# Altium schematic sheet 03 - AEM10941.SchDoc: Boost Converter
size A4; DrawnBy: LS, OB, AB, AG, IM; Organization: Miromico, ETHZ; Revision: 3; SheetNumber: 4; SheetTotal: 5; SchemaTitle: Harvester
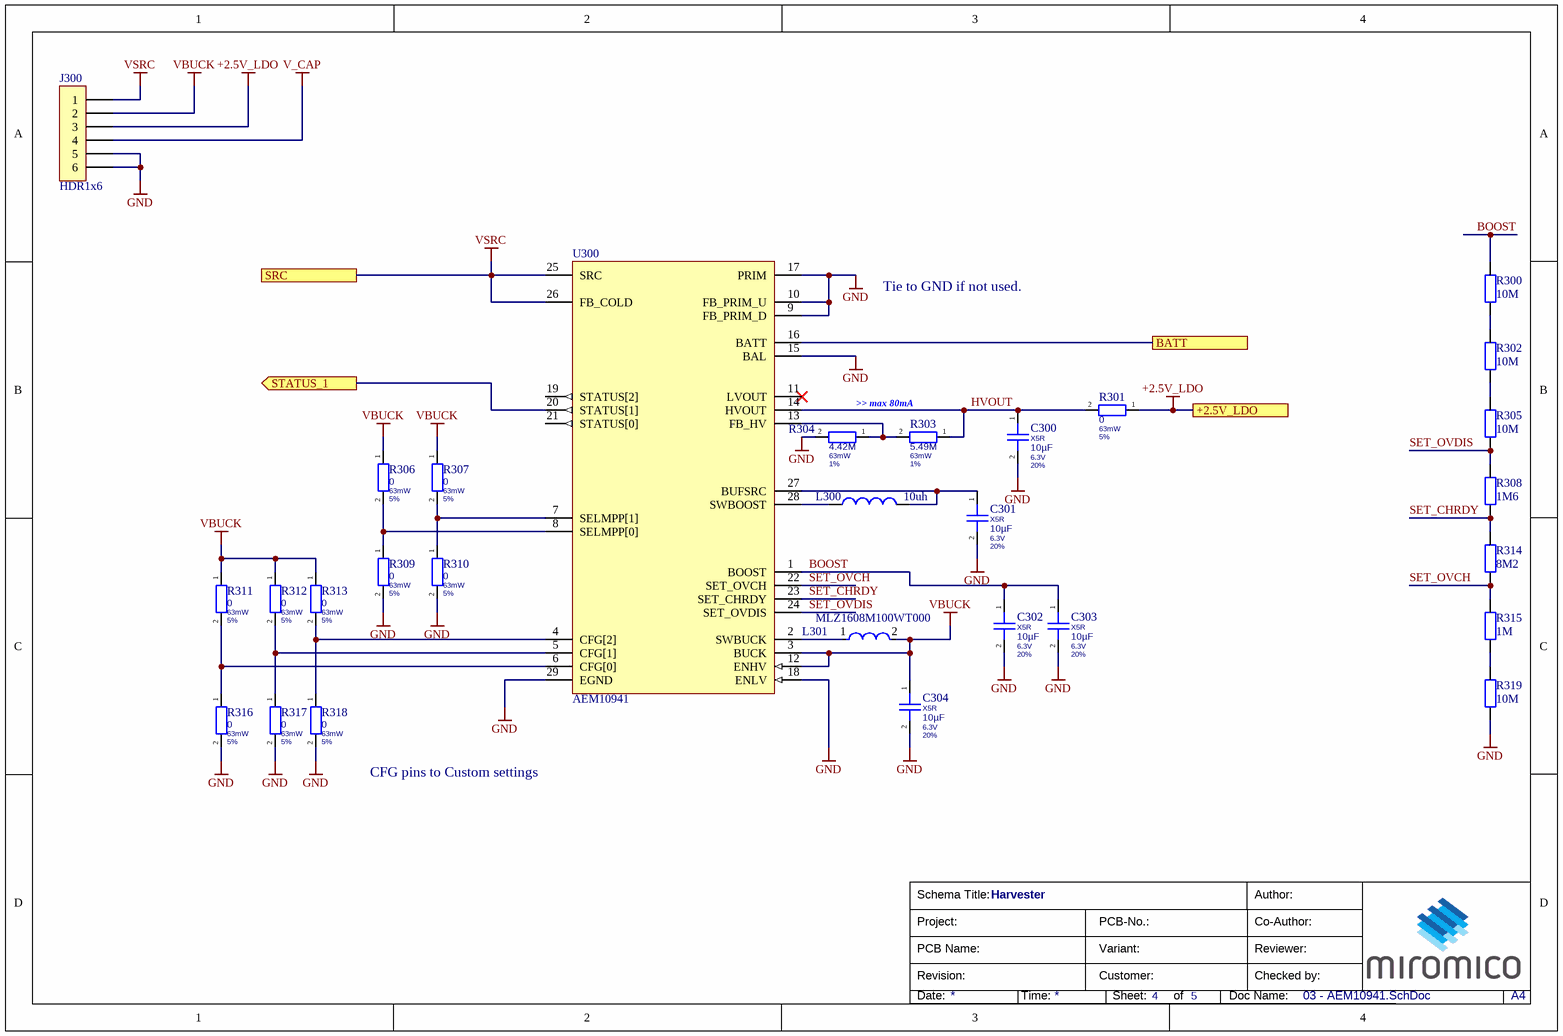
[diagram p0: 03 - AEM10941.SchDoc]

## Parts
C300  Dielectric: X5R  Capacitance: 10µF  Voltage Rating: 6.3V  Tolerance: 20%  [CAPC0402(1005)60_L]  (hidden comment: GRJ155R60J106ME11D)
C301  Dielectric: X5R  Capacitance: 10µF  Voltage Rating: 6.3V  Tolerance: 20%  [CAPC0402(1005)60_L]  (hidden comment: GRJ155R60J106ME11D)
C302  Dielectric: X5R  Capacitance: 10µF  Voltage Rating: 6.3V  Tolerance: 20%  [CAPC0402(1005)60_L]  (hidden comment: GRJ155R60J106ME11D)
C303  Dielectric: X5R  Capacitance: 10µF  Voltage Rating: 6.3V  Tolerance: 20%  [CAPC0402(1005)60_L]  (hidden comment: GRJ155R60J106ME11D)
C304  Dielectric: X5R  Capacitance: 10µF  Voltage Rating: 6.3V  Tolerance: 20%  [CAPC0402(1005)60_L]  (hidden comment: GRJ155R60J106ME11D)
J300  HDR1x6  [HDR1x6]
L300  Inductance: 10uh  [INDC0805(2012)X11_L]  (hidden comment: CKS2125100M-T)
L301  MLZ1608M100WT000  [FP-MLZ1608-MFG]
R300  10M  [RESC0402(1005)_L]
R301  Resistance: 0  Power Rating: 63mW  Tolerance: 5%  [RESC0402(1005)_L]  (hidden comment: RMCF0402ZT0R00)
R302  10M  [RESC0402(1005)_L]
R303  Resistance: 5.49M  Power Rating: 63mW  Tolerance: 1%  [RESC0402(1005)_L]  (hidden comment: CRCW04025M49FKED)
R304  Resistance: 4.42M  Power Rating: 63mW  Tolerance: 1%  [RESC0402(1005)_L]  (hidden comment: CRCW04024M42FKED)
R305  10M  [RESC0402(1005)_L]
R306  Resistance: 0  Power Rating: 63mW  Tolerance: 5%  [RESC0402(1005)_L]  (hidden comment: RMCF0402ZT0R00)
R307  Resistance: 0  Power Rating: 63mW  Tolerance: 5%  [RESC0402(1005)_L]  (hidden comment: RMCF0402ZT0R00)
R308  1M6  [RESC0402(1005)_L]
R309  Resistance: 0  Power Rating: 63mW  Tolerance: 5%  [RESC0402(1005)_L]  (hidden comment: RMCF0402ZT0R00)
R310  Resistance: 0  Power Rating: 63mW  Tolerance: 5%  [RESC0402(1005)_L]  (hidden comment: RMCF0402ZT0R00)
R311  Resistance: 0  Power Rating: 63mW  Tolerance: 5%  [RESC0402(1005)_L]  (hidden comment: RMCF0402ZT0R00)
R312  Resistance: 0  Power Rating: 63mW  Tolerance: 5%  [RESC0402(1005)_L]  (hidden comment: RMCF0402ZT0R00)
R313  Resistance: 0  Power Rating: 63mW  Tolerance: 5%  [RESC0402(1005)_L]  (hidden comment: RMCF0402ZT0R00)
R314  8M2  [RESC0402(1005)_L]
R315  1M  [RESC0402(1005)_L]
R316  Resistance: 0  Power Rating: 63mW  Tolerance: 5%  [RESC0402(1005)_L]  (hidden comment: RMCF0402ZT0R00)
R317  Resistance: 0  Power Rating: 63mW  Tolerance: 5%  [RESC0402(1005)_L]  (hidden comment: RMCF0402ZT0R00)
R318  Resistance: 0  Power Rating: 63mW  Tolerance: 5%  [RESC0402(1005)_L]  (hidden comment: RMCF0402ZT0R00)
R319  10M  [RESC0402(1005)_L]
U300  AEM10941  [QFN50P500X500X85_HS-29N]

## Ports
+2.5V_LDO, BATT, SRC, STATUS_1 (out)

## Nets
+2.5V_LDO: J300.3 R301.1 ; port +2.5V_LDO
GND: C300.2 C301.2 C302.2 C303.2 C304.2 J300.5 J300.6 R304.2 R309.2 R310.2 R316.2 R317.2 R318.2 R319.2 U300.9(FB_PRIM_D) U300.10(FB_PRIM_U) U300.15(BAL) U300.17(PRIM) U300.18(ENLV) U300.29(EGND)
V_CAP: J300.4
VBUCK: C304.1 J300.2 L301.2 R306.1 R307.1 R311.1 R312.1 R313.1 U300.3(BUCK) U300.12(ENHV)
VSRC: J300.1 U300.25(SRC) U300.26(FB_COLD) ; port SRC
BATT: U300.16(BATT) ; port BATT
BOOST: C302.1 C303.1 R300.1 U300.1(BOOST)
HVOUT: C300.1 R301.2 R303.1 U300.14(HVOUT)
SET_CHRDY: R308.2 R314.1 U300.23(SET_CHRDY)
SET_OVCH: R314.2 R315.1 U300.22(SET_OVCH)
SET_OVDIS: R305.2 R308.1 U300.24(SET_OVDIS)
STATUS_1: U300.20(STATUS[1]) ; port STATUS_1
NetC301_1: C301.1 L300.2 U300.27(BUFSRC)
NetL300_1: L300.1 U300.28(SWBOOST)
NetL301_1: L301.1 U300.2(SWBUCK)
NetR300_2: R300.2 R302.1
NetR302_2: R302.2 R305.1
NetR303_2: R303.2 R304.1 U300.13(FB_HV)
NetR306_2: R306.2 R309.1 U300.8(SELMPP[0])
NetR307_2: R307.2 R310.1 U300.7(SELMPP[1])
NetR311_2: R311.2 R316.1 U300.6(CFG[0])
NetR312_2: R312.2 R317.1 U300.5(CFG[1])
NetR313_2: R313.2 R318.1 U300.4(CFG[2])
NetR315_2: R315.2 R319.1

Not connected (* = marked no-connect by the designer): U300 11(LVOUT)* 19(STATUS[2]) 21(STATUS[0])

## Notes on the sheet
- Tie to GND if not used.
- >> max 80mA
- CFG pins to Custom settings
- Schema Title:
- Project:
- PCB-No.:
- Author:
- Co-Author:
- Revision:
- PCB Name:
- Customer:
- Variant:
- Reviewer:
- Checked by:
- Date:
- Time:
- Sheet:
- of
- Doc Name:
- A4

## Library data of the parts
C300-C304 = CMP-00462-01: 10µF ±20% 6.3V Ceramic Capacitor X5R 0402 (1005 Metric); Manufacturer: Murata Electronics; ComponentLink1Description: Datasheet; Manufacturer Part Number: GRJ155R60J106ME11D; Supplier 1: Digi-Key; Supplier Part Number 1: 490-13211-1-ND; Mount: Surface Mount; Case/Package: 0402; Case Code (Metric): 1005; Case Code (Imperial): 0402; Min Operating Temperature: -55°C; Max Operating Temperature: 85°C; Packaging: Cut Tape; Features: Soft Termination; Length: 0.039inch; Width: 0.02inch; Thickness: 0.028inch
J300 = HDR1x6-01: 1x6 Pin Header, 2.54mm; Properties: 1x6 Pin Terminal Header, 2.54mm; SchLibComponentName: HDR1x6
L300 = CMP-00871-1: FIXED IND 10UH 110MA 520 MOHM; Core Material: Ferrite; Tolerance: 20%; Shielding: Unshielded; Self Resonant Frequency: 24MHz; DC Resistance (DCR): 520mR; Test Frequency: 2MHz; Mount: Surface Mount; Case/Package: 0805; Case Code (Metric): 2012; Case Code (Imperial): 0805; Min Operating Temperature: -40°C; Max Operating Temperature: 85°C; Package Quantity: 2000; Current Rating: 110mA; Packaging: Tape and Reel; Inductance Tolerance: 20%; Max DC Current: 110mA; Termination: SMD/SMT; DC Current: 110mA; Military Standard: Not; Length: 2mm; Height: 1.25mm; Width: 0.049inch; Height - Seated (Max): 0.057inch; Depth: 1.45mm; Radiation Hardening: No; REACH SVHC: Unknown; Lead Free: Lead Free; Halogen Free: Halogen Free
L301 = CMP-08253-000012-1: FIXED IND 10UH 250MA 1.05 OHM; Manufacturer: TDK; Series Resistance: 1.05Ω; Tolerance: 20%; Shielding: true; Core Material: Ferrite; Saturation Current: 90mA; Test Frequency: 2MHz; Digikey Description: FIXED IND 10UH 250MA 1.05 OHM; Inductance: 10uH; Composition: Multilayer; Device Class L3: Fixed Inductors; Temperature: -55°C to +125°C; RoHS: TRUE; Temperature Range High: +125°C; Automotive: No; Device Class L2: Inductors; Value: 10uH; Temperature Range Low: -55°C; Rms Current: 250mA; Manufacturer Part Number: MLZ1608M100WT000; Category: Ind; Height: 0.95mm; Package: MLZ1608; Device Class L1: Passive Components; Lead Free: Yes; ComponentLink2Description: Datasheet; Octopart: https://octopart.com/mlz1608m100wt000-tdk-22244539; Ipc Land Pattern Name: CAPC16080X80; ComponentLink2URL: https://product.tdk.com/info/en/catalog/datasheets/inductor_commercial_decoupling_mlz1608_en.pdf
R300 R302 R305 R308 R314 R315 R319 = R_Chip-08: Chip Resistor; Properties: 1%; SchLibComponentName: R_Chip
R301 R306 R307 R309-R313 R316-R318 = CMP-00412-07: 0 Ohms Jumper 0.063W, 1/16W Chip Resistor 0402 (1005 Metric) Automotive AEC-Q200 Thick Film; Manufacturer: Stackpole Electronics Inc; ComponentLink1Description: Datasheet; ComponentLink1URL: https://www.seielect.com/catalog/sei-rmcf_rmcp.pdf; Manufacturer Part Number: RMCF0402ZT0R00; Supplier 1: Digi-Key; Supplier Part Number 1: RMCF0402ZT0R00CT-ND; Max Power Dissipation: 63mW
R303 = CMP-00501-01: 5.49 MOhms ±1% 0.063W, 1/16W Chip Resistor 0402 (1005 Metric) Automotive AEC-Q200 Thick Film; Manufacturer: Vishay Dale; Voltage Rating: 50V; Temperature Coefficient: 100ppm/°C; ComponentLink1Description: Datasheet; ComponentLink1URL: https://www.vishay.com/docs/20035/dcrcwe3.pdf; Manufacturer Part Number: CRCW04025M49FKED; Supplier 1: Digi-Key; Supplier Part Number 1: 541-5.49MLCT-ND; Case/Package: 0402; Number of Pins: 2; Weight: 2.3E-05oz; Case Code (Metric): 1005; Case Code (Imperial): 0402; Contact Plating: Tin; Min Operating Temperature: -55°C; Max Operating Temperature: 155°C; Packaging: Tape and Reel; Package Quantity: 10; Resistor Type: Thick Film; Number of Terminations: 2; Termination: SMD/SMT; Max Power Dissipation: 63mW; Voltage Rating (DC): 50V; Features: Automotive AEC-Q200; Length: 1mm; Width: 0.02inch; Height: 0.016inch; Depth: 0.5mm; REACH SVHC: Unknown; Military Standard: Not; Lead Free: Lead Free
R304 = CMP-00502-01: 4.42 MOhms ±1% 0.063W, 1/16W Chip Resistor 0402 (1005 Metric) Automotive AEC-Q200 Thick Film; Manufacturer: Vishay Dale; Voltage Rating: 50V; Temperature Coefficient: 100ppm/°C; ComponentLink1Description: Datasheet; ComponentLink1URL: https://www.vishay.com/docs/20035/dcrcwe3.pdf; Manufacturer Part Number: CRCW04024M42FKED; Supplier 1: Digi-Key; Supplier Part Number 1: 541-4.42MLCT-ND; Case/Package: 0402; Number of Pins: 2; Weight: 2.3E-05oz; Case Code (Imperial): 0402; Case Code (Metric): 1005; Contact Plating: Tin; Min Operating Temperature: -55°C; Max Operating Temperature: 155°C; Package Quantity: 10; Packaging: Tape and Reel; Resistor Type: Thick Film; Termination: SMD/SMT; Number of Terminations: 2; Max Power Dissipation: 63mW; Voltage Rating (DC): 50V; Features: Automotive AEC-Q200; Length: 1mm; Width: 0.5mm; Height: 0.016inch; Depth: 0.5mm; Radiation Hardening: No; REACH SVHC: Unknown; Military Standard: Not; Lead Free: Lead Free
U300 = CMP-00302-04: Highly-efficient, regulated dual-output, ambient energy manager; Manufacturer: e-peas; ComponentLink1Description: Datasheet; Manufacturer Part Number: AEM10941; Supplier 1: e-peas; Supplier Part Number 1: AEM10941